# Altium project Condor2.PrjPcb
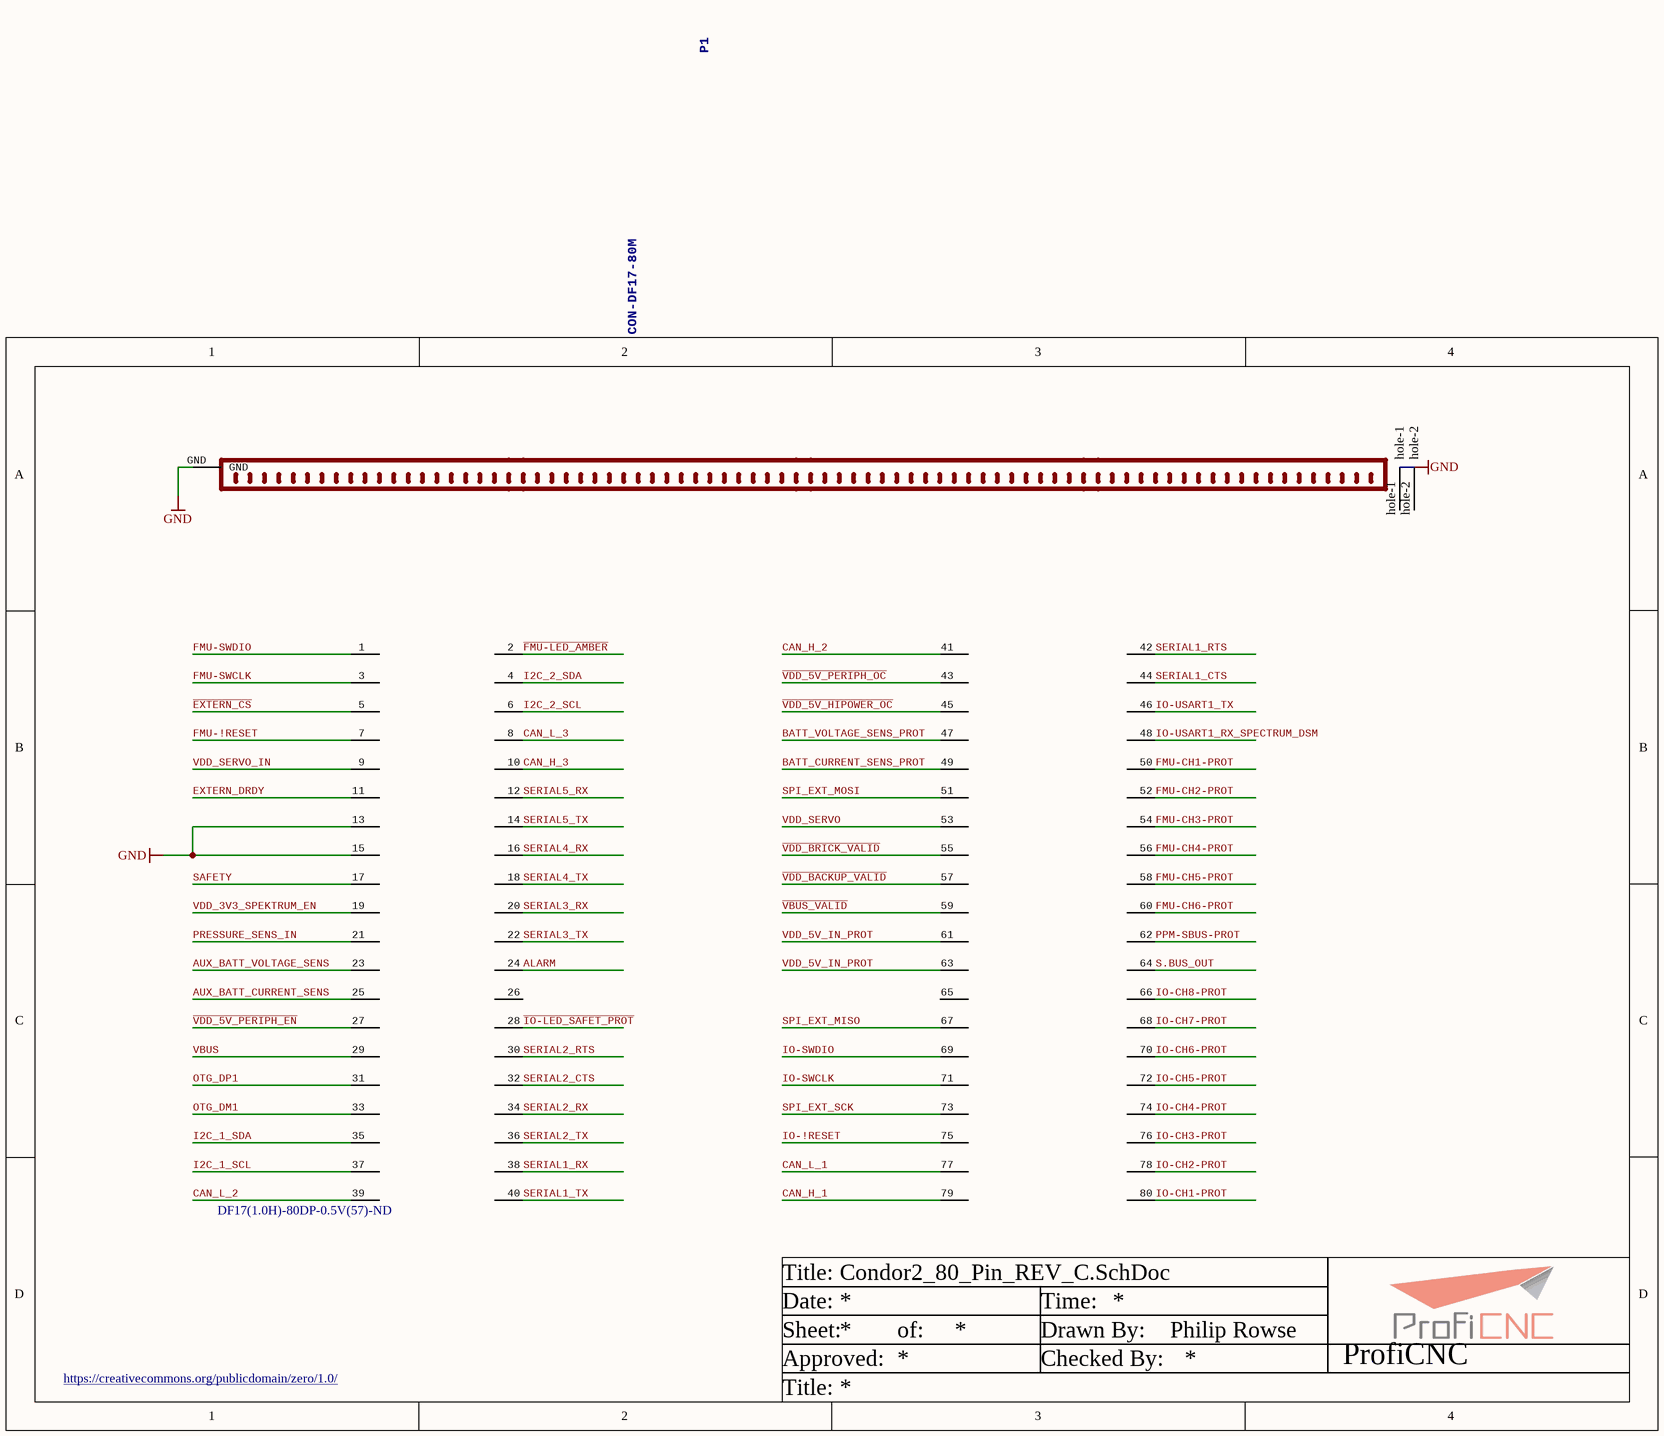
[diagram p0: Condor2_80_Pin_REV_C.SchDoc]
8 sheets, 66 parts. Net scope: global (net labels, ports and power ports of the same name join across sheets).
Board file: Condor2_REV_C.PcbDoc
Sheets:
  Condor2_80_Pin_REV_C.SchDoc
  Condor2_NTEL_REV_C.SchDoc
  Condor2_Plugs_REV_C.SchDoc
  Condor2__Power_REV_C.SchDoc
  Condor2_Servo_REV_C.SchDoc
  Condor2_tp_REV_C.SchDoc
  Condor2_CV_Sensors.SchDoc
  Condor2_ESC.SchDoc

## Sheet Condor2_80_Pin_REV_C.SchDoc
size A4; DrawnBy: Philip Rowse

### Parts
P1  CON-DF17-80M  Supplier Part Number 1: DF17(1.0H)-80DP-0.5V(57)-ND  [CON-DF17-80M]

### Nets
GND: P1.13 P1.15 P1.GND
ALARM: P1.24
AUX_BATT_CURRENT_SENS: P1.25
AUX_BATT_VOLTAGE_SENS: P1.23
BATT_CURRENT_SENS_PROT: P1.49
BATT_VOLTAGE_SENS_PROT: P1.47
CAN_H_1: P1.79
CAN_H_2: P1.41
CAN_H_3: P1.10
CAN_L_1: P1.77
CAN_L_2: P1.39
CAN_L_3: P1.8
~{EXTERN_CS}: P1.5
EXTERN_DRDY: P1.11
~{FMU-LED_AMBER}: P1.2
FMU-!RESET: P1.7
FMU-CH1-PROT: P1.50
FMU-CH2-PROT: P1.52
FMU-CH3-PROT: P1.54
FMU-CH4-PROT: P1.56
FMU-CH5-PROT: P1.58
FMU-CH6-PROT: P1.60
FMU-SWCLK: P1.3
FMU-SWDIO: P1.1
I2C_1_SCL: P1.37
I2C_1_SDA: P1.35
I2C_2_SCL: P1.6
I2C_2_SDA: P1.4
~{IO-LED_SAFET_PROT}: P1.28
IO-!RESET: P1.75
IO-CH1-PROT: P1.80
IO-CH2-PROT: P1.78
IO-CH3-PROT: P1.76
IO-CH4-PROT: P1.74
IO-CH5-PROT: P1.72
IO-CH6-PROT: P1.70
IO-CH7-PROT: P1.68
IO-CH8-PROT: P1.66
IO-SWCLK: P1.71
IO-SWDIO: P1.69
IO-USART1_RX_SPECTRUM_DSM: P1.48
IO-USART1_TX: P1.46
OTG_DM1: P1.33
OTG_DP1: P1.31
PPM-SBUS-PROT: P1.62
PRESSURE_SENS_IN: P1.21
S.BUS_OUT: P1.64
SAFETY: P1.17
SERIAL1_CTS: P1.44
SERIAL1_RTS: P1.42
SERIAL1_RX: P1.38
SERIAL1_TX: P1.40
SERIAL2_CTS: P1.32
SERIAL2_RTS: P1.30
SERIAL2_RX: P1.34
SERIAL2_TX: P1.36
SERIAL3_RX: P1.20
SERIAL3_TX: P1.22
SERIAL4_RX: P1.16
SERIAL4_TX: P1.18
SERIAL5_RX: P1.12
SERIAL5_TX: P1.14
SPI_EXT_MISO: P1.67
SPI_EXT_MOSI: P1.51
SPI_EXT_SCK: P1.73
~{VBUS_VALID}: P1.59
~{VDD_5V_HIPOWER_OC}: P1.45
~{VDD_5V_PERIPH_EN}: P1.27
~{VDD_5V_PERIPH_OC}: P1.43
~{VDD_BACKUP_VALID}: P1.57
~{VDD_BRICK_VALID}: P1.55
VBUS: P1.29
VDD_3V3_SPEKTRUM_EN: P1.19
VDD_5V_IN_PROT: P1.61 P1.63
VDD_SERVO: P1.53
VDD_SERVO_IN: P1.9

Not connected (* = marked no-connect by the designer): P1 26 65 hole-1 hole-2

### Notes on the sheet
- Title:
- Date:
- Time:
- https://creativecommons.org/publicdomain/zero/1.0/
- Sheet:
- Approved:
- of:
- Drawn By:
- Checked By:
- ProfiCNC

### Library data of the parts
P1 = CON-DF17-80M: Connector, Header, 80Pos, .5MM, DUAL, SMD, Au; Supplier 1: Digi-Key

## Sheet Condor2_NTEL_REV_C.SchDoc
size A4; DrawnBy: Philip Rowse

### Notes on the sheet
- Title:
- Date:
- Time:
- https://creativecommons.org/publicdomain/zero/1.0/
- Sheet:
- Approved:
- of:
- Drawn By:
- Checked By:
- ProfiCNC

## Sheet Condor2_Plugs_REV_C.SchDoc
size A4; DrawnBy: Philip Rowse
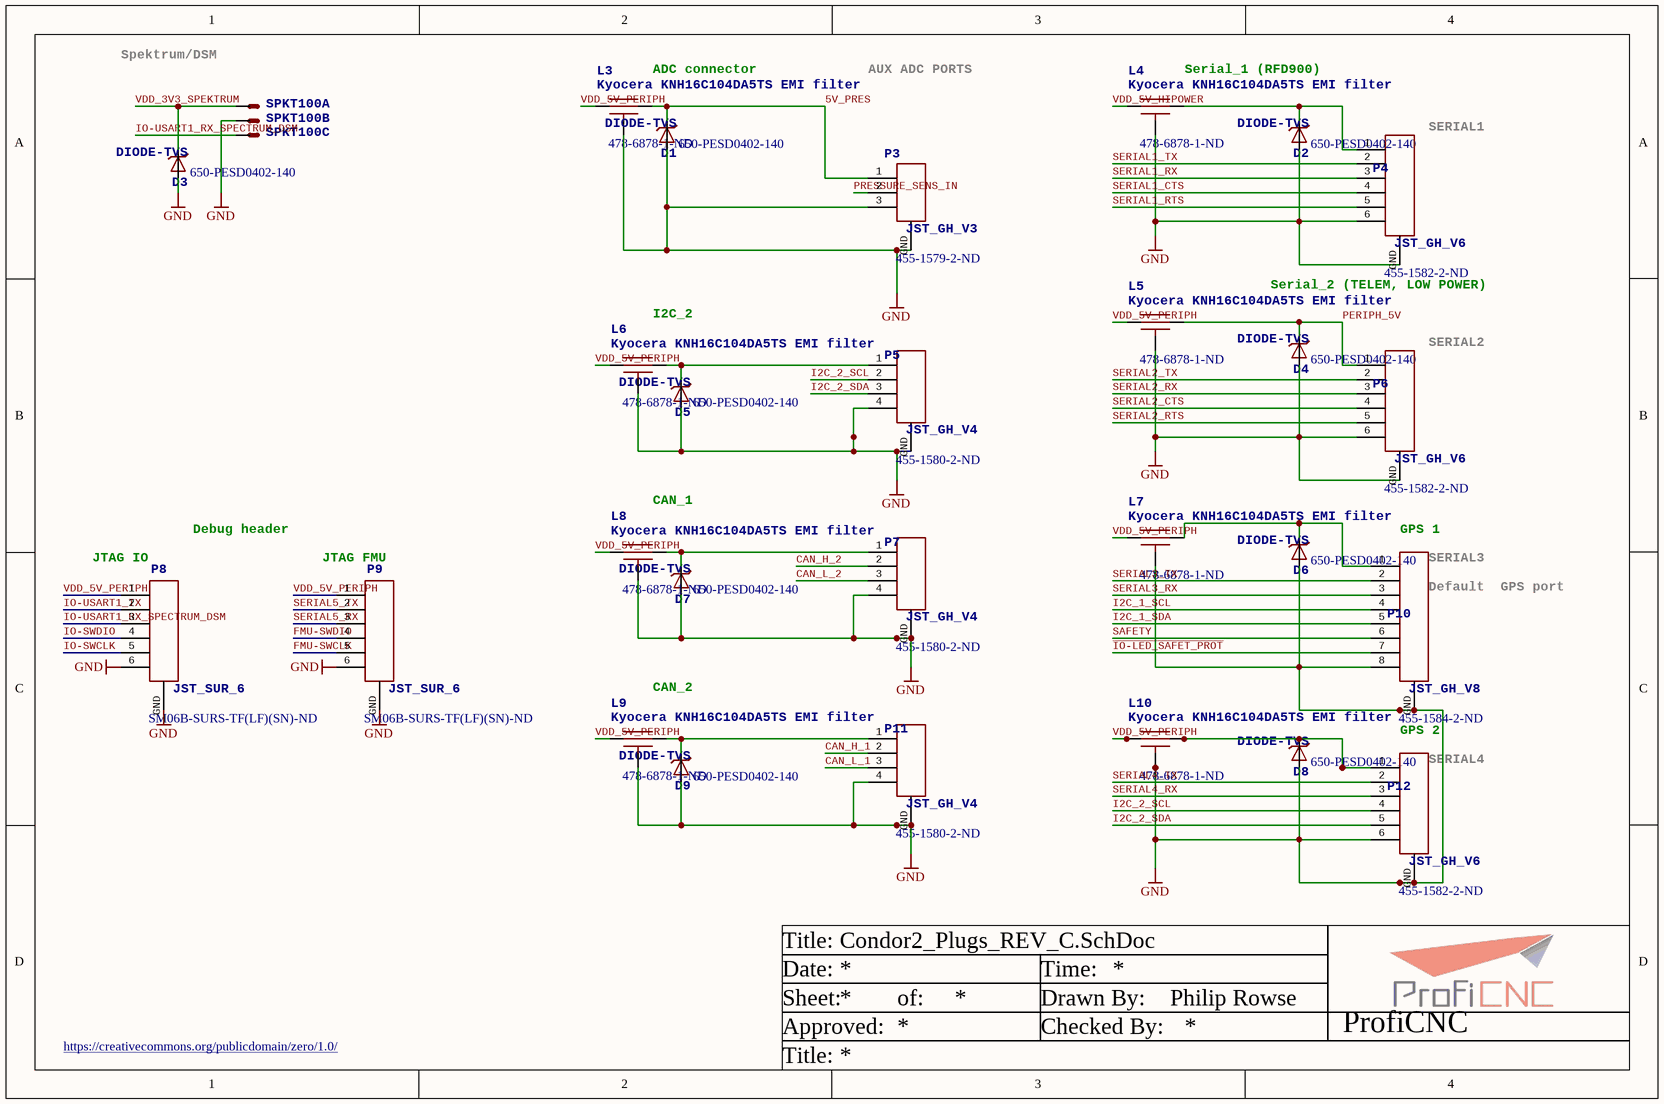
[diagram p1: Condor2_Plugs_REV_C.SchDoc]

### Parts
D1  DIODE-TVS  Supplier Part Number 1: 650-PESD0402-140  [0402-TVS]
D2  DIODE-TVS  Supplier Part Number 1: 650-PESD0402-140  [0402-TVS]
D3  DIODE-TVS  Supplier Part Number 1: 650-PESD0402-140  [0402-TVS]
D4  DIODE-TVS  Supplier Part Number 1: 650-PESD0402-140  [0402-TVS]
D5  DIODE-TVS  Supplier Part Number 1: 650-PESD0402-140  [0402-TVS]
D6  DIODE-TVS  Supplier Part Number 1: 650-PESD0402-140  [0402-TVS]
D7  DIODE-TVS  Supplier Part Number 1: 650-PESD0402-140  [0402-TVS]
D8  DIODE-TVS  Supplier Part Number 1: 650-PESD0402-140  [0402-TVS]
D9  DIODE-TVS  Supplier Part Number 1: 650-PESD0402-140  [0402-TVS]
L3  Kyocera KNH16C104DA5TS EMI filter  Supplier Part Number 1: 478-6878-1-ND  [KYOCERA-KNH16-DA]
L4  Kyocera KNH16C104DA5TS EMI filter  Supplier Part Number 1: 478-6878-1-ND  [KYOCERA-KNH16-DA]
L5  Kyocera KNH16C104DA5TS EMI filter  Supplier Part Number 1: 478-6878-1-ND  [KYOCERA-KNH16-DA]
L6  Kyocera KNH16C104DA5TS EMI filter  Supplier Part Number 1: 478-6878-1-ND  [KYOCERA-KNH16-DA]
L7  Kyocera KNH16C104DA5TS EMI filter  Supplier Part Number 1: 478-6878-1-ND  [KYOCERA-KNH16-DA]
L8  Kyocera KNH16C104DA5TS EMI filter  Supplier Part Number 1: 478-6878-1-ND  [KYOCERA-KNH16-DA]
L9  Kyocera KNH16C104DA5TS EMI filter  Supplier Part Number 1: 478-6878-1-ND  [KYOCERA-KNH16-DA]
L10  Kyocera KNH16C104DA5TS EMI filter  Supplier Part Number 1: 478-6878-1-ND  [KYOCERA-KNH16-DA]
P3  JST_GH_V3  Supplier Part Number 1: 455-1579-2-ND  [JST_GH_V3]
P4  JST_GH_V6  Supplier Part Number 1: 455-1582-2-ND  [JST_GH_V6]
P5  JST_GH_V4  Supplier Part Number 1: 455-1580-2-ND  [JST_GH_V4]
P6  JST_GH_V6  Supplier Part Number 1: 455-1582-2-ND  [JST_GH_V6]
P7  JST_GH_V4  Supplier Part Number 1: 455-1580-2-ND  [JST_GH_V4]
P8  JST_SUR_6  Supplier Part Number 1: SM06B-SURS-TF(LF)(SN)-ND  [JST_SUR_H6]
P9  JST_SUR_6  Supplier Part Number 1: SM06B-SURS-TF(LF)(SN)-ND  [JST_SUR_H6]
P10  JST_GH_V8  Supplier Part Number 1: 455-1584-2-ND  [JST_GH_V8]
P11  JST_GH_V4  Supplier Part Number 1: 455-1580-2-ND  [JST_GH_V4]
P12  JST_GH_V6  Supplier Part Number 1: 455-1582-2-ND  [JST_GH_V6]
SPKT100  CONN_SPEKTRUM_RX-TH  [B3B-ZR]  (value not drawn)  (parts A,B,C of 3)

### Nets
GND: D1.A D2.A D3.A D4.A D5.A D6.A D7.A D8.A D9.A L3.GND L4.GND L5.GND L6.GND L7.GND L8.GND L9.GND L10.GND P3.3 P3.GND P4.6 P4.GND P5.4 P5.GND P6.6 P6.GND P7.4 P7.GND P8.6 P8.GND P9.6 P9.GND P10.8 P10.GND P11.4 P11.GND P12.6 P12.GND SPKT100.2(S)
5V_PRES: D1.C L3.P$2 P3.1
CAN_H_1: P11.2
CAN_H_2: P7.2
CAN_L_1: P11.3
CAN_L_2: P7.3
FMU-SWCLK: P9.5
FMU-SWDIO: P9.4
I2C_1_SCL: P10.4
I2C_1_SDA: P10.5
I2C_2_SCL: P5.2 P12.4
I2C_2_SDA: P5.3 P12.5
~{IO-LED_SAFET_PROT}: P10.7
IO-SWCLK: P8.5
IO-SWDIO: P8.4
IO-USART1_RX_SPECTRUM_DSM: P8.3 SPKT100.1(S)
IO-USART1_TX: P8.2
PERIPH_5V: D4.C L5.P$2 P6.1
PRESSURE_SENS_IN: P3.2
SAFETY: P10.6
SERIAL1_CTS: P4.4
SERIAL1_RTS: P4.5
SERIAL1_RX: P4.3
SERIAL1_TX: P4.2
SERIAL2_CTS: P6.4
SERIAL2_RTS: P6.5
SERIAL2_RX: P6.3
SERIAL2_TX: P6.2
SERIAL3_RX: P10.3
SERIAL3_TX: P10.2
SERIAL4_RX: P12.3
SERIAL4_TX: P12.2
SERIAL5_RX: P9.3
SERIAL5_TX: P9.2
VDD_3V3_SPEKTRUM: D3.C SPKT100.3(S)
VDD_5V_HIPOWER: L4.P$1
VDD_5V_PERIPH: L3.P$1 L5.P$1 L6.P$1 L7.P$1 L8.P$1 L9.P$1 L10.P$1 P8.1 P9.1
NetD2_C: D2.C L4.P$2 P4.1
NetD5_C: D5.C L6.P$2 P5.1
NetD6_C: D6.C L7.P$2 P10.1
NetD7_C: D7.C L8.P$2 P7.1
NetD8_C: D8.C L10.P$2 P12.1
NetD9_C: D9.C L9.P$2 P11.1

### Notes on the sheet
- Spektrum/DSM
- (near L3) ADC connector
- AUX ADC PORTS
- (near L4) Serial_1 (RFD900)
- (near P4) SERIAL1
- (near L6) I2C_2
- Serial_2 (TELEM, LOW POWER)
- (near P6) SERIAL2
- Debug header
- (near L8) CAN_1
- (near P10) GPS 1
- (near P8) JTAG IO
- (near P9) JTAG FMU
- (near P10) SERIAL3
- (near P10) Default
  GPS port
- (near L9) CAN_2
- GPS 2
- (near P12) SERIAL4
- Title:
- Date:
- Time:
- https://creativecommons.org/publicdomain/zero/1.0/
- Sheet:
- Approved:
- of:
- Drawn By:
- Checked By:
- ProfiCNC

### Library data of the parts
D1-D9 = DIODE-TVS: Diode, TVS, 14VWM, 40VC, 0402, SMD; Supplier 1: Mouser
L3-L10 = KNH16C104DA5TS: Capacitor, Filter, 0.1uF, 25V, 2A, 0603, SMD; Supplier 1: Digi-Key
P3 = JST_GH_V3: BM03B-GHS-TBT; Supplier 1: Digi-Key
P4 P6 P12 = JST_GH_V6: BM06B-GHS-TBT; Supplier 1: Digi-Key
P5 P7 P11 = JST_GH_V4: BM04B-GHS-TBT; Supplier 1: Digi-Key
P8 P9 = JST_SUR_6: Connector, Header, 6Pos, .8mm IDC, R/A, SMD, Tin; Supplier 1: Digi-Key
P10 = JST_GH_V8: BM08B-GHS-TBT; Supplier 1: Digi-Key
SPKT100 = CONN_SPEKTRUM_RX-TH: Spektrum RX connector; JST ZH series S3B-ZR-SM4A-TF; PARTNO: B3B-ZR(LF)(SN)

## Sheet Condor2__Power_REV_C.SchDoc
size A4; DrawnBy: Philip Rowse
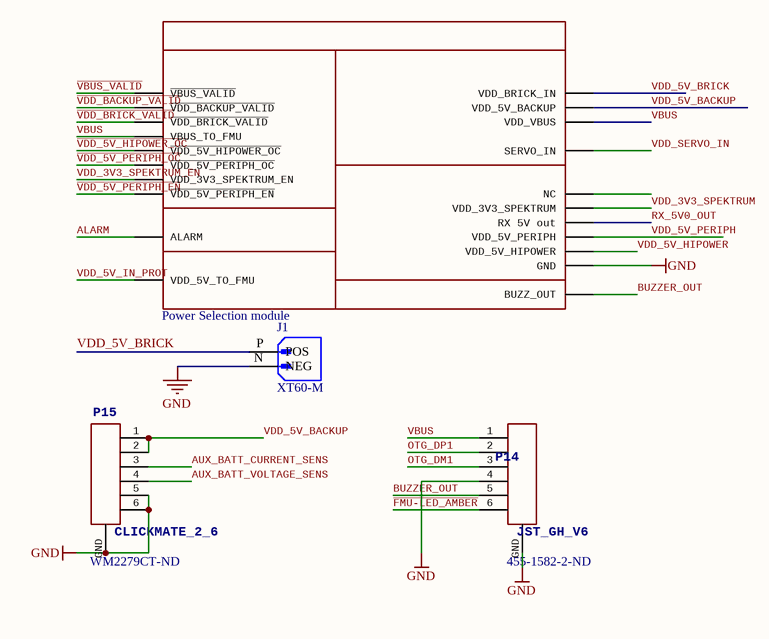
[diagram p2: Condor2__Power_REV_C.SchDoc]

### Parts
J1  XT60-M  [AMASS_XT60-M]
P14  JST_GH_V6  Supplier Part Number 1: 455-1582-2-ND  [JST_GH_V6]
P15  CLICKMATE_2_6  Supplier Part Number 1: WM2279CT-ND  [CLICKMATE_V6_2MM]
PSM1  Power Selection module  [PSM]

### Nets
GND: J1.N(NEG) P14.4 P14.GND P15.5 P15.6 P15.GND PSM1.GND
ALARM: PSM1.ALARM
AUX_BATT_CURRENT_SENS: P15.3
AUX_BATT_VOLTAGE_SENS: P15.4
BUZZER_OUT: P14.5 PSM1.BUZZER_OUT(BUZZ_OUT)
~{FMU-LED_AMBER}: P14.6
OTG_DM1: P14.3
OTG_DP1: P14.2
RX_5V0_OUT: PSM1.RX(RX_5V_out)
~{VBUS_VALID}: PSM1.!VBUS_VALID(~{VBUS_VALID})
~{VDD_5V_HIPOWER_OC}: PSM1.!VDD_5V_HIPOWER_OC(~{VDD_5V_HIPOWER_OC})
~{VDD_5V_PERIPH_EN}: PSM1.!VDD_5V_PERIPH_EN(~{VDD_5V_PERIPH_EN})
~{VDD_5V_PERIPH_OC}: PSM1.!VDD_5V_PERIPH_OC(~{VDD_5V_PERIPH_OC})
~{VDD_BACKUP_VALID}: PSM1.!VDD_BACKUP_VALID(~{VDD_BACKUP_VALID})
~{VDD_BRICK_VALID}: PSM1.!VDD_BRICK_VALID(~{VDD_BRICK_VALID})
VBUS: P14.1 PSM1.VBUS(VBUS_TO_FMU) PSM1.VDD_VBUS
VDD_3V3_SPEKTRUM: PSM1.SPEK(VDD_3V3_SPEKTRUM)
VDD_3V3_SPEKTRUM_EN: PSM1.VDD_3V3_SPEKTRUM_EN
VDD_5V_BACKUP: P15.1 P15.2 PSM1.VDD_5V_BACKUP
VDD_5V_BRICK: J1.P(POS) PSM1.VDD_BRICK_IN
VDD_5V_HIPOWER: PSM1.5V_HIPOWER(VDD_5V_HIPOWER)
VDD_5V_IN_PROT: PSM1.VDD_5V_IN_PROT(VDD_5V_TO_FMU)
VDD_5V_PERIPH: PSM1.5V_PERIPH(VDD_5V_PERIPH)
VDD_SERVO_IN: PSM1.SERVO_IN

Not connected (* = marked no-connect by the designer): PSM1 NC

### Notes on the sheet
- Title:
- Date:
- Time:
- https://creativecommons.org/publicdomain/zero/1.0/
- Sheet:
- Approved:
- of:
- Drawn By:
- Checked By:
- ProfiCNC

### Library data of the parts
J1 = XT60-M: Plug; DC supply; XT60; male; PIN: 2; for cable; soldered; 30A; 500V; MF: AMASS; Price: None; Availability: Not in stock; Package: Package; MP: XT60-M; Value: *; SnapEDA_Link: https://www.snapeda.com/parts/XT60-M/AMASS/view-part/?ref=snap; Check_prices: https://www.snapeda.com/parts/XT60-M/AMASS/view-part/?ref=eda
P14 = JST_GH_V6: BM06B-GHS-TBT; Supplier 1: Digi-Key
P15 = CLICKMATE_2_6: Connector, Header, 6Pos, 2.54MM, Vert, THT, Au; Supplier 1: Digi-Key
PSM1 = PSMPSM: PCA, PSM, Assembly

## Sheet Condor2_Servo_REV_C.SchDoc
size A4; DrawnBy: Philip Rowse
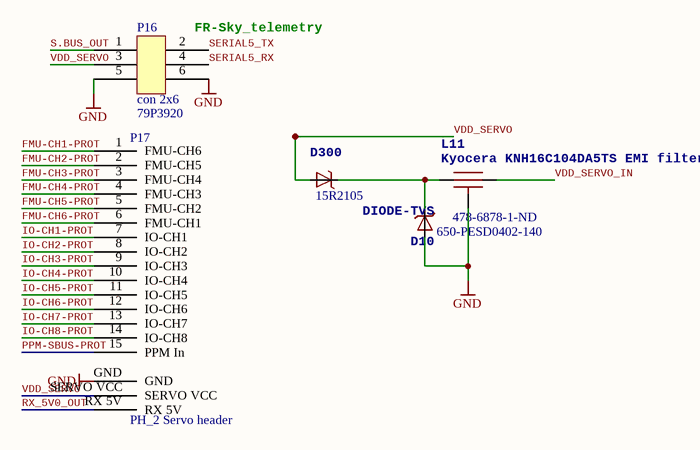
[diagram p3: Condor2_Servo_REV_C.SchDoc]

### Parts
D10  DIODE-TVS  Supplier Part Number 1: 650-PESD0402-140  [0402-TVS]
D300  Supplier Part Number 1: 15R2105  [MICROSMP]  (hidden comment: MSS1P4-M3)
L11  Kyocera KNH16C104DA5TS EMI filter  Supplier Part Number 1: 478-6878-1-ND  [KYOCERA-KNH16-DA]
P16  con 2x6  Supplier Part Number 1: 79P3920  [TSW-103-07-G-D]
P17  PH_2 Servo header  [TSW-115-08-G-T-RA]

### Nets
GND: D10.A L11.GND P16.5 P16.6 P17.GND
FMU-CH1-PROT: P17.1(FMU-CH6)
FMU-CH2-PROT: P17.2(FMU-CH5)
FMU-CH3-PROT: P17.3(FMU-CH4)
FMU-CH4-PROT: P17.4(FMU-CH3)
FMU-CH5-PROT: P17.5(FMU-CH2)
FMU-CH6-PROT: P17.6(FMU-CH1)
IO-CH1-PROT: P17.7(IO-CH1)
IO-CH2-PROT: P17.8(IO-CH2)
IO-CH3-PROT: P17.9(IO-CH3)
IO-CH4-PROT: P17.10(IO-CH4)
IO-CH5-PROT: P17.11(IO-CH5)
IO-CH6-PROT: P17.12(IO-CH6)
IO-CH7-PROT: P17.13(IO-CH7)
IO-CH8-PROT: P17.14(IO-CH8)
PPM-SBUS-PROT: P17.15(PPM_In)
RX_5V0_OUT: P17.RX_5V
S.BUS_OUT: P16.1
SERIAL5_RX: P16.4
SERIAL5_TX: P16.2
VDD_SERVO: D300.ANODE(A) P16.3 P17.SERVO_VCC
VDD_SERVO_IN: L11.P$2
NetD10_C: D10.C D300.CATHODE(C) L11.P$1

### Notes on the sheet
- (near P16) FR-Sky_telemetry
- Title
- Size:
- Date:
- A4
- Number:
- Time:
- Revision:
- Sheet
- of
- File:

### Library data of the parts
D10 = DIODE-TVS: Diode, TVS, 14VWM, 40VC, 0402, SMD; Supplier 1: Mouser
D300 = DIODE-SCHOTTKY_MSMP: Diode, Schottky, 40V, 1A, MicroSMP, SMD; Supplier 1: Newark
L11 = KNH16C104DA5TS: as L3 on sheet Condor2_Plugs_REV_C; Supplier 1: Digi-Key
P16 = con 2x6: Connector, Header, 6Pos, 2.54MM, Vert, THT, Au; Supplier 1: Newark
P17 = PH_2 Servo header: Connector, Header, 45Pos, 2.54MM, R/A, THT, Tin

## Sheet Condor2_tp_REV_C.SchDoc
size A4; DrawnBy: Philip Rowse
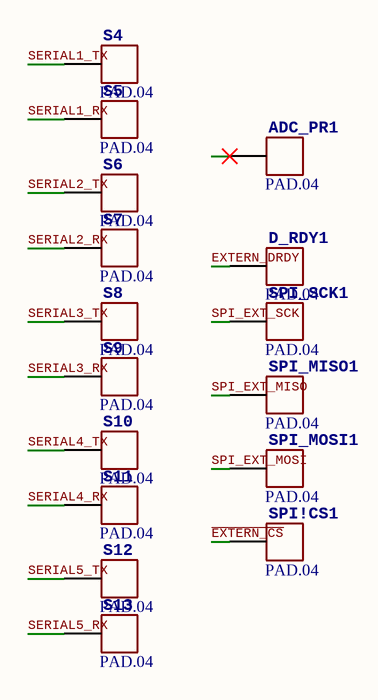
[diagram p4: Condor2_tp_REV_C.SchDoc]

### Parts
ADC_PR1  PAD.04  [PAD.04X.04]
D_RDY1  PAD.04  [PAD.04X.04]
S4  PAD.04  [PAD.04X.04]
S5  PAD.04  [PAD.04X.04]
S6  PAD.04  [PAD.04X.04]
S7  PAD.04  [PAD.04X.04]
S8  PAD.04  [PAD.04X.04]
S9  PAD.04  [PAD.04X.04]
S10  PAD.04  [PAD.04X.04]
S11  PAD.04  [PAD.04X.04]
S12  PAD.04  [PAD.04X.04]
S13  PAD.04  [PAD.04X.04]
SPI!CS1  PAD.04  [PAD.04X.04]
SPI_MISO1  PAD.04  [PAD.04X.04]
SPI_MOSI1  PAD.04  [PAD.04X.04]
SPI_SCK1  PAD.04  [PAD.04X.04]

### Nets
~{EXTERN_CS}: SPI!CS1.P$1
EXTERN_DRDY: D_RDY1.P$1
SERIAL1_RX: S5.P$1
SERIAL1_TX: S4.P$1
SERIAL2_RX: S7.P$1
SERIAL2_TX: S6.P$1
SERIAL3_RX: S9.P$1
SERIAL3_TX: S8.P$1
SERIAL4_RX: S11.P$1
SERIAL4_TX: S10.P$1
SERIAL5_RX: S13.P$1
SERIAL5_TX: S12.P$1
SPI_EXT_MISO: SPI_MISO1.P$1
SPI_EXT_MOSI: SPI_MOSI1.P$1
SPI_EXT_SCK: SPI_SCK1.P$1

Not connected (* = marked no-connect by the designer): ADC_PR1 P$1*

### Notes on the sheet
- Title:
- Date:
- Time:
- https://creativecommons.org/publicdomain/zero/1.0/
- Sheet:
- Approved:
- of:
- Drawn By:
- Checked By:
- ProfiCNC

## Sheet Condor2_CV_Sensors.SchDoc
size A4
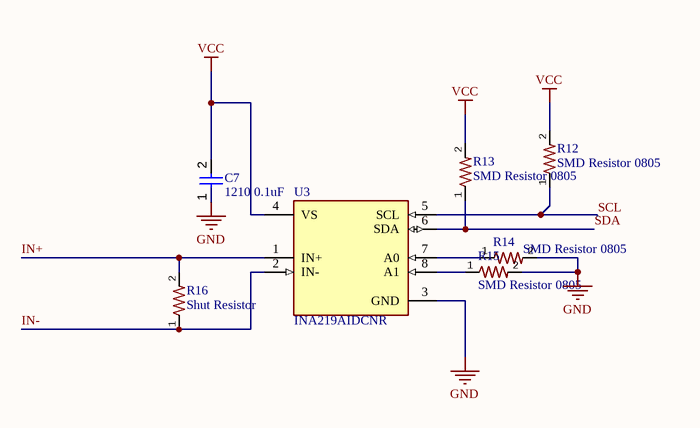
[diagram p5: Condor2_CV_Sensors.SchDoc]

### Parts
C7  1210 0.1uF  [1210]
R12  SMD Resistor 0805  [RES 0805]
R13  SMD Resistor 0805  [RES 0805]
R14  SMD Resistor 0805  [RES 0805]
R15  SMD Resistor 0805  [RES 0805]
R16  Shut Resistor  [PT2512]
U3  INA219AIDCNR  [INA219]

### Nets
GND: C7.1 R14.2 R15.2 U3.3(GND)
VCC: C7.2 R12.2 R13.2 U3.4(VS)
IN+: R16.2 U3.1(IN+)
IN-: R16.1 U3.2(IN-)
SCL: R12.1 U3.5(SCL)
SDA: R13.1 U3.6(SDA)
NetR14_1: R14.1 U3.7(A0)
NetR15_1: R15.1 U3.8(A1)

### Library data of the parts
C7 = Capacitor 1210
R16 = PT2512FK
U3 = INA219: IC CURRENT MONITOR 1% SOT23-8; Common Mode Rejection Ratio: 100dB; Bandwidth: 3.4MHz; Operating Supply Current: 1mA; Nominal Supply Current: 700uA; Min Input Voltage: 0V; Output Current per Channel: 10mA; Number of Amplifiers: 1; Input Offset Voltage (Vos): 100uV; Max Input Voltage: 26V; Min Supply Voltage: 3V; Max Supply Current: 5mA; Max Supply Voltage: 5.5V; Output Type: Digital; Accuracy: 1%; Radiation Hardening: No; Min Operating Temperature: -40°C; Contact Plating: Gold; REACH SVHC: No SVHC; Packaging: Tape and Reel; Max Operating Temperature: 125°C; Lead Free: Lead Free; Weight: 0.001411oz; Supply Current: 700uA; Number of Pins: 8; Length: 3mm; Quiescent Current: 700uA; Features: I²C; Height: 1.3mm; Output Current: 10mA; Case/Package: SOT-23-8; RoHS Compliant: Yes; Width: 1.75mm; Package Quantity: 3000; Series: Zero-Drift

## Sheet Condor2_ESC.SchDoc
size A4
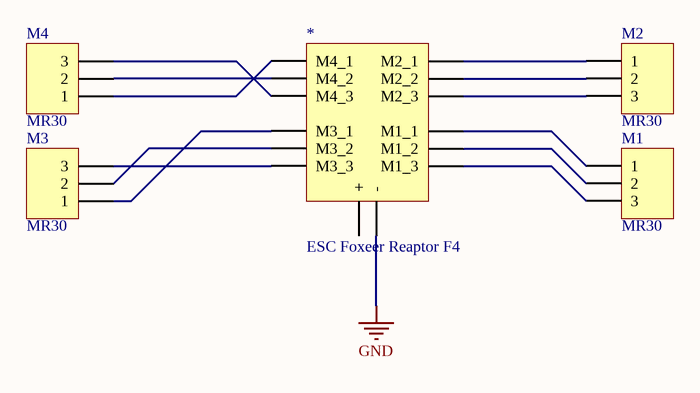
[diagram p6: Condor2_ESC.SchDoc]

### Parts
*  ESC Foxeer Reaptor F4  [FOXEeR REAPER]
M1  MR30  [MR30]
M2  MR30  [MR30]
M3  MR30  [MR30]
M4  MR30  [MR30]

### Nets
GND: *.8(-)
Net*_1: *.1(M4_1) M4.1
Net*_2: *.2(M4_2) M4.2
Net*_3: *.3(M4_3) M4.3
Net*_4: *.4(M3_1) M3.1
Net*_5: *.5(M3_2) M3.2
Net*_6: *.6(M3_3) M3.3
Net*_9: *.9(M1_3) M1.3
Net*_10: *.10(M1_2) M1.2
Net*_11: *.11(M1_1) M1.1
Net*_12: *.12(M2_3) M2.3
Net*_13: *.13(M2_2) M2.2
Net*_14: *.14(M2_1) M2.1

Not connected (* = marked no-connect by the designer): * 7(+)

### Library data of the parts
M1-M4 = MR30: LatestRevisionDate: 17-Jul-2002; LatestRevisionNote: Re-released for DXP Platform.; Publisher: Altium Limited

## Nets that join several sheets
GND: Condor2_80_Pin_REV_C (P1.13 P1.15 P1.GND), Condor2_Plugs_REV_C (38 pins), Condor2__Power_REV_C (7 pins), Condor2_Servo_REV_C (5 pins), Condor2_CV_Sensors (C7.1 R14.2 R15.2 U3.3), Condor2_ESC (*.8)
ALARM: Condor2_80_Pin_REV_C (P1.24), Condor2__Power_REV_C (PSM1.ALARM)
AUX_BATT_CURRENT_SENS: Condor2_80_Pin_REV_C (P1.25), Condor2__Power_REV_C (P15.3)
AUX_BATT_VOLTAGE_SENS: Condor2_80_Pin_REV_C (P1.23), Condor2__Power_REV_C (P15.4)
CAN_H_1: Condor2_80_Pin_REV_C (P1.79), Condor2_Plugs_REV_C (P11.2)
CAN_H_2: Condor2_80_Pin_REV_C (P1.41), Condor2_Plugs_REV_C (P7.2)
CAN_L_1: Condor2_80_Pin_REV_C (P1.77), Condor2_Plugs_REV_C (P11.3)
CAN_L_2: Condor2_80_Pin_REV_C (P1.39), Condor2_Plugs_REV_C (P7.3)
~{EXTERN_CS}: Condor2_80_Pin_REV_C (P1.5), Condor2_tp_REV_C (SPI!CS1.P$1)
EXTERN_DRDY: Condor2_80_Pin_REV_C (P1.11), Condor2_tp_REV_C (D_RDY1.P$1)
~{FMU-LED_AMBER}: Condor2_80_Pin_REV_C (P1.2), Condor2__Power_REV_C (P14.6)
FMU-CH1-PROT: Condor2_80_Pin_REV_C (P1.50), Condor2_Servo_REV_C (P17.1)
FMU-CH2-PROT: Condor2_80_Pin_REV_C (P1.52), Condor2_Servo_REV_C (P17.2)
FMU-CH3-PROT: Condor2_80_Pin_REV_C (P1.54), Condor2_Servo_REV_C (P17.3)
FMU-CH4-PROT: Condor2_80_Pin_REV_C (P1.56), Condor2_Servo_REV_C (P17.4)
FMU-CH5-PROT: Condor2_80_Pin_REV_C (P1.58), Condor2_Servo_REV_C (P17.5)
FMU-CH6-PROT: Condor2_80_Pin_REV_C (P1.60), Condor2_Servo_REV_C (P17.6)
FMU-SWCLK: Condor2_80_Pin_REV_C (P1.3), Condor2_Plugs_REV_C (P9.5)
FMU-SWDIO: Condor2_80_Pin_REV_C (P1.1), Condor2_Plugs_REV_C (P9.4)
I2C_1_SCL: Condor2_80_Pin_REV_C (P1.37), Condor2_Plugs_REV_C (P10.4)
I2C_1_SDA: Condor2_80_Pin_REV_C (P1.35), Condor2_Plugs_REV_C (P10.5)
I2C_2_SCL: Condor2_80_Pin_REV_C (P1.6), Condor2_Plugs_REV_C (P5.2 P12.4)
I2C_2_SDA: Condor2_80_Pin_REV_C (P1.4), Condor2_Plugs_REV_C (P5.3 P12.5)
~{IO-LED_SAFET_PROT}: Condor2_80_Pin_REV_C (P1.28), Condor2_Plugs_REV_C (P10.7)
IO-CH1-PROT: Condor2_80_Pin_REV_C (P1.80), Condor2_Servo_REV_C (P17.7)
IO-CH2-PROT: Condor2_80_Pin_REV_C (P1.78), Condor2_Servo_REV_C (P17.8)
IO-CH3-PROT: Condor2_80_Pin_REV_C (P1.76), Condor2_Servo_REV_C (P17.9)
IO-CH4-PROT: Condor2_80_Pin_REV_C (P1.74), Condor2_Servo_REV_C (P17.10)
IO-CH5-PROT: Condor2_80_Pin_REV_C (P1.72), Condor2_Servo_REV_C (P17.11)
IO-CH6-PROT: Condor2_80_Pin_REV_C (P1.70), Condor2_Servo_REV_C (P17.12)
IO-CH7-PROT: Condor2_80_Pin_REV_C (P1.68), Condor2_Servo_REV_C (P17.13)
IO-CH8-PROT: Condor2_80_Pin_REV_C (P1.66), Condor2_Servo_REV_C (P17.14)
IO-SWCLK: Condor2_80_Pin_REV_C (P1.71), Condor2_Plugs_REV_C (P8.5)
IO-SWDIO: Condor2_80_Pin_REV_C (P1.69), Condor2_Plugs_REV_C (P8.4)
IO-USART1_RX_SPECTRUM_DSM: Condor2_80_Pin_REV_C (P1.48), Condor2_Plugs_REV_C (P8.3 SPKT100.1)
IO-USART1_TX: Condor2_80_Pin_REV_C (P1.46), Condor2_Plugs_REV_C (P8.2)
OTG_DM1: Condor2_80_Pin_REV_C (P1.33), Condor2__Power_REV_C (P14.3)
OTG_DP1: Condor2_80_Pin_REV_C (P1.31), Condor2__Power_REV_C (P14.2)
PPM-SBUS-PROT: Condor2_80_Pin_REV_C (P1.62), Condor2_Servo_REV_C (P17.15)
PRESSURE_SENS_IN: Condor2_80_Pin_REV_C (P1.21), Condor2_Plugs_REV_C (P3.2)
RX_5V0_OUT: Condor2__Power_REV_C (PSM1.RX), Condor2_Servo_REV_C (P17.RX 5V)
S.BUS_OUT: Condor2_80_Pin_REV_C (P1.64), Condor2_Servo_REV_C (P16.1)
SAFETY: Condor2_80_Pin_REV_C (P1.17), Condor2_Plugs_REV_C (P10.6)
SERIAL1_CTS: Condor2_80_Pin_REV_C (P1.44), Condor2_Plugs_REV_C (P4.4)
SERIAL1_RTS: Condor2_80_Pin_REV_C (P1.42), Condor2_Plugs_REV_C (P4.5)
SERIAL1_RX: Condor2_80_Pin_REV_C (P1.38), Condor2_Plugs_REV_C (P4.3), Condor2_tp_REV_C (S5.P$1)
SERIAL1_TX: Condor2_80_Pin_REV_C (P1.40), Condor2_Plugs_REV_C (P4.2), Condor2_tp_REV_C (S4.P$1)
SERIAL2_CTS: Condor2_80_Pin_REV_C (P1.32), Condor2_Plugs_REV_C (P6.4)
SERIAL2_RTS: Condor2_80_Pin_REV_C (P1.30), Condor2_Plugs_REV_C (P6.5)
SERIAL2_RX: Condor2_80_Pin_REV_C (P1.34), Condor2_Plugs_REV_C (P6.3), Condor2_tp_REV_C (S7.P$1)
SERIAL2_TX: Condor2_80_Pin_REV_C (P1.36), Condor2_Plugs_REV_C (P6.2), Condor2_tp_REV_C (S6.P$1)
SERIAL3_RX: Condor2_80_Pin_REV_C (P1.20), Condor2_Plugs_REV_C (P10.3), Condor2_tp_REV_C (S9.P$1)
SERIAL3_TX: Condor2_80_Pin_REV_C (P1.22), Condor2_Plugs_REV_C (P10.2), Condor2_tp_REV_C (S8.P$1)
SERIAL4_RX: Condor2_80_Pin_REV_C (P1.16), Condor2_Plugs_REV_C (P12.3), Condor2_tp_REV_C (S11.P$1)
SERIAL4_TX: Condor2_80_Pin_REV_C (P1.18), Condor2_Plugs_REV_C (P12.2), Condor2_tp_REV_C (S10.P$1)
SERIAL5_RX: Condor2_80_Pin_REV_C (P1.12), Condor2_Plugs_REV_C (P9.3), Condor2_Servo_REV_C (P16.4), Condor2_tp_REV_C (S13.P$1)
SERIAL5_TX: Condor2_80_Pin_REV_C (P1.14), Condor2_Plugs_REV_C (P9.2), Condor2_Servo_REV_C (P16.2), Condor2_tp_REV_C (S12.P$1)
SPI_EXT_MISO: Condor2_80_Pin_REV_C (P1.67), Condor2_tp_REV_C (SPI_MISO1.P$1)
SPI_EXT_MOSI: Condor2_80_Pin_REV_C (P1.51), Condor2_tp_REV_C (SPI_MOSI1.P$1)
SPI_EXT_SCK: Condor2_80_Pin_REV_C (P1.73), Condor2_tp_REV_C (SPI_SCK1.P$1)
~{VBUS_VALID}: Condor2_80_Pin_REV_C (P1.59), Condor2__Power_REV_C (PSM1.!VBUS_VALID)
~{VDD_5V_HIPOWER_OC}: Condor2_80_Pin_REV_C (P1.45), Condor2__Power_REV_C (PSM1.!VDD_5V_HIPOWER_OC)
~{VDD_5V_PERIPH_EN}: Condor2_80_Pin_REV_C (P1.27), Condor2__Power_REV_C (PSM1.!VDD_5V_PERIPH_EN)
~{VDD_5V_PERIPH_OC}: Condor2_80_Pin_REV_C (P1.43), Condor2__Power_REV_C (PSM1.!VDD_5V_PERIPH_OC)
~{VDD_BACKUP_VALID}: Condor2_80_Pin_REV_C (P1.57), Condor2__Power_REV_C (PSM1.!VDD_BACKUP_VALID)
~{VDD_BRICK_VALID}: Condor2_80_Pin_REV_C (P1.55), Condor2__Power_REV_C (PSM1.!VDD_BRICK_VALID)
VBUS: Condor2_80_Pin_REV_C (P1.29), Condor2__Power_REV_C (P14.1 PSM1.VBUS PSM1.VDD_VBUS)
VDD_3V3_SPEKTRUM: Condor2_Plugs_REV_C (D3.C SPKT100.3), Condor2__Power_REV_C (PSM1.SPEK)
VDD_3V3_SPEKTRUM_EN: Condor2_80_Pin_REV_C (P1.19), Condor2__Power_REV_C (PSM1.VDD_3V3_SPEKTRUM_EN)
VDD_5V_HIPOWER: Condor2_Plugs_REV_C (L4.P$1), Condor2__Power_REV_C (PSM1.5V_HIPOWER)
VDD_5V_IN_PROT: Condor2_80_Pin_REV_C (P1.61 P1.63), Condor2__Power_REV_C (PSM1.VDD_5V_IN_PROT)
VDD_5V_PERIPH: Condor2_Plugs_REV_C (9 pins), Condor2__Power_REV_C (PSM1.5V_PERIPH)
VDD_SERVO: Condor2_80_Pin_REV_C (P1.53), Condor2_Servo_REV_C (D300.ANODE P16.3 P17.SERVO VCC)
VDD_SERVO_IN: Condor2_80_Pin_REV_C (P1.9), Condor2__Power_REV_C (PSM1.SERVO_IN), Condor2_Servo_REV_C (L11.P$2)

## Assembly variants
Normal_CB: not fitted ADC_PR BATT600 C600 C601 C602 C603 C604 C605 D_RDY1 EDISON600 JP400 JP401 L600 L601 LED600 LED601 LOGO1 LOGO2 LV600 LV601 LV602 LV603 LV604 LV605 M3_MOUNT901 M3_MOUNT902 M3_MOUNT903 M3_MOUNT904 Nut 600 Nut 601 P600 R600 R603 R605 R606 R607 R608 R609 R610 R611 R612 R613 S1RX S1TX S2RX S2TX S3RX S3TX S4RX S4TX S5_RX S5_TX S600 S601 S602 SPI!CS1 SPI_MISO1 SPI_MOSI1 SPI_SCK1 U601 U603 USB600 USB601
INTEL_CB: not fitted ADC_PR D_RDY1 EDISON600 JP400 JP401 LOGO1 LOGO2 M3_MOUNT901 M3_MOUNT902 M3_MOUNT903 M3_MOUNT904 S1RX S1TX S2RX S2TX S3RX S3TX S4RX S4TX S5_RX S5_TX SPI!CS1 SPI_MISO1 SPI_MOSI1 SPI_SCK1